# Altium schematic sheet robotShield.SchDoc: RobotShield Atmega328p
size 431 x 279 mm; Author: Mahdi Nikkhah; Engineer: Mahdi Nikkhah; SheetNumber: 1; SheetTotal: 1
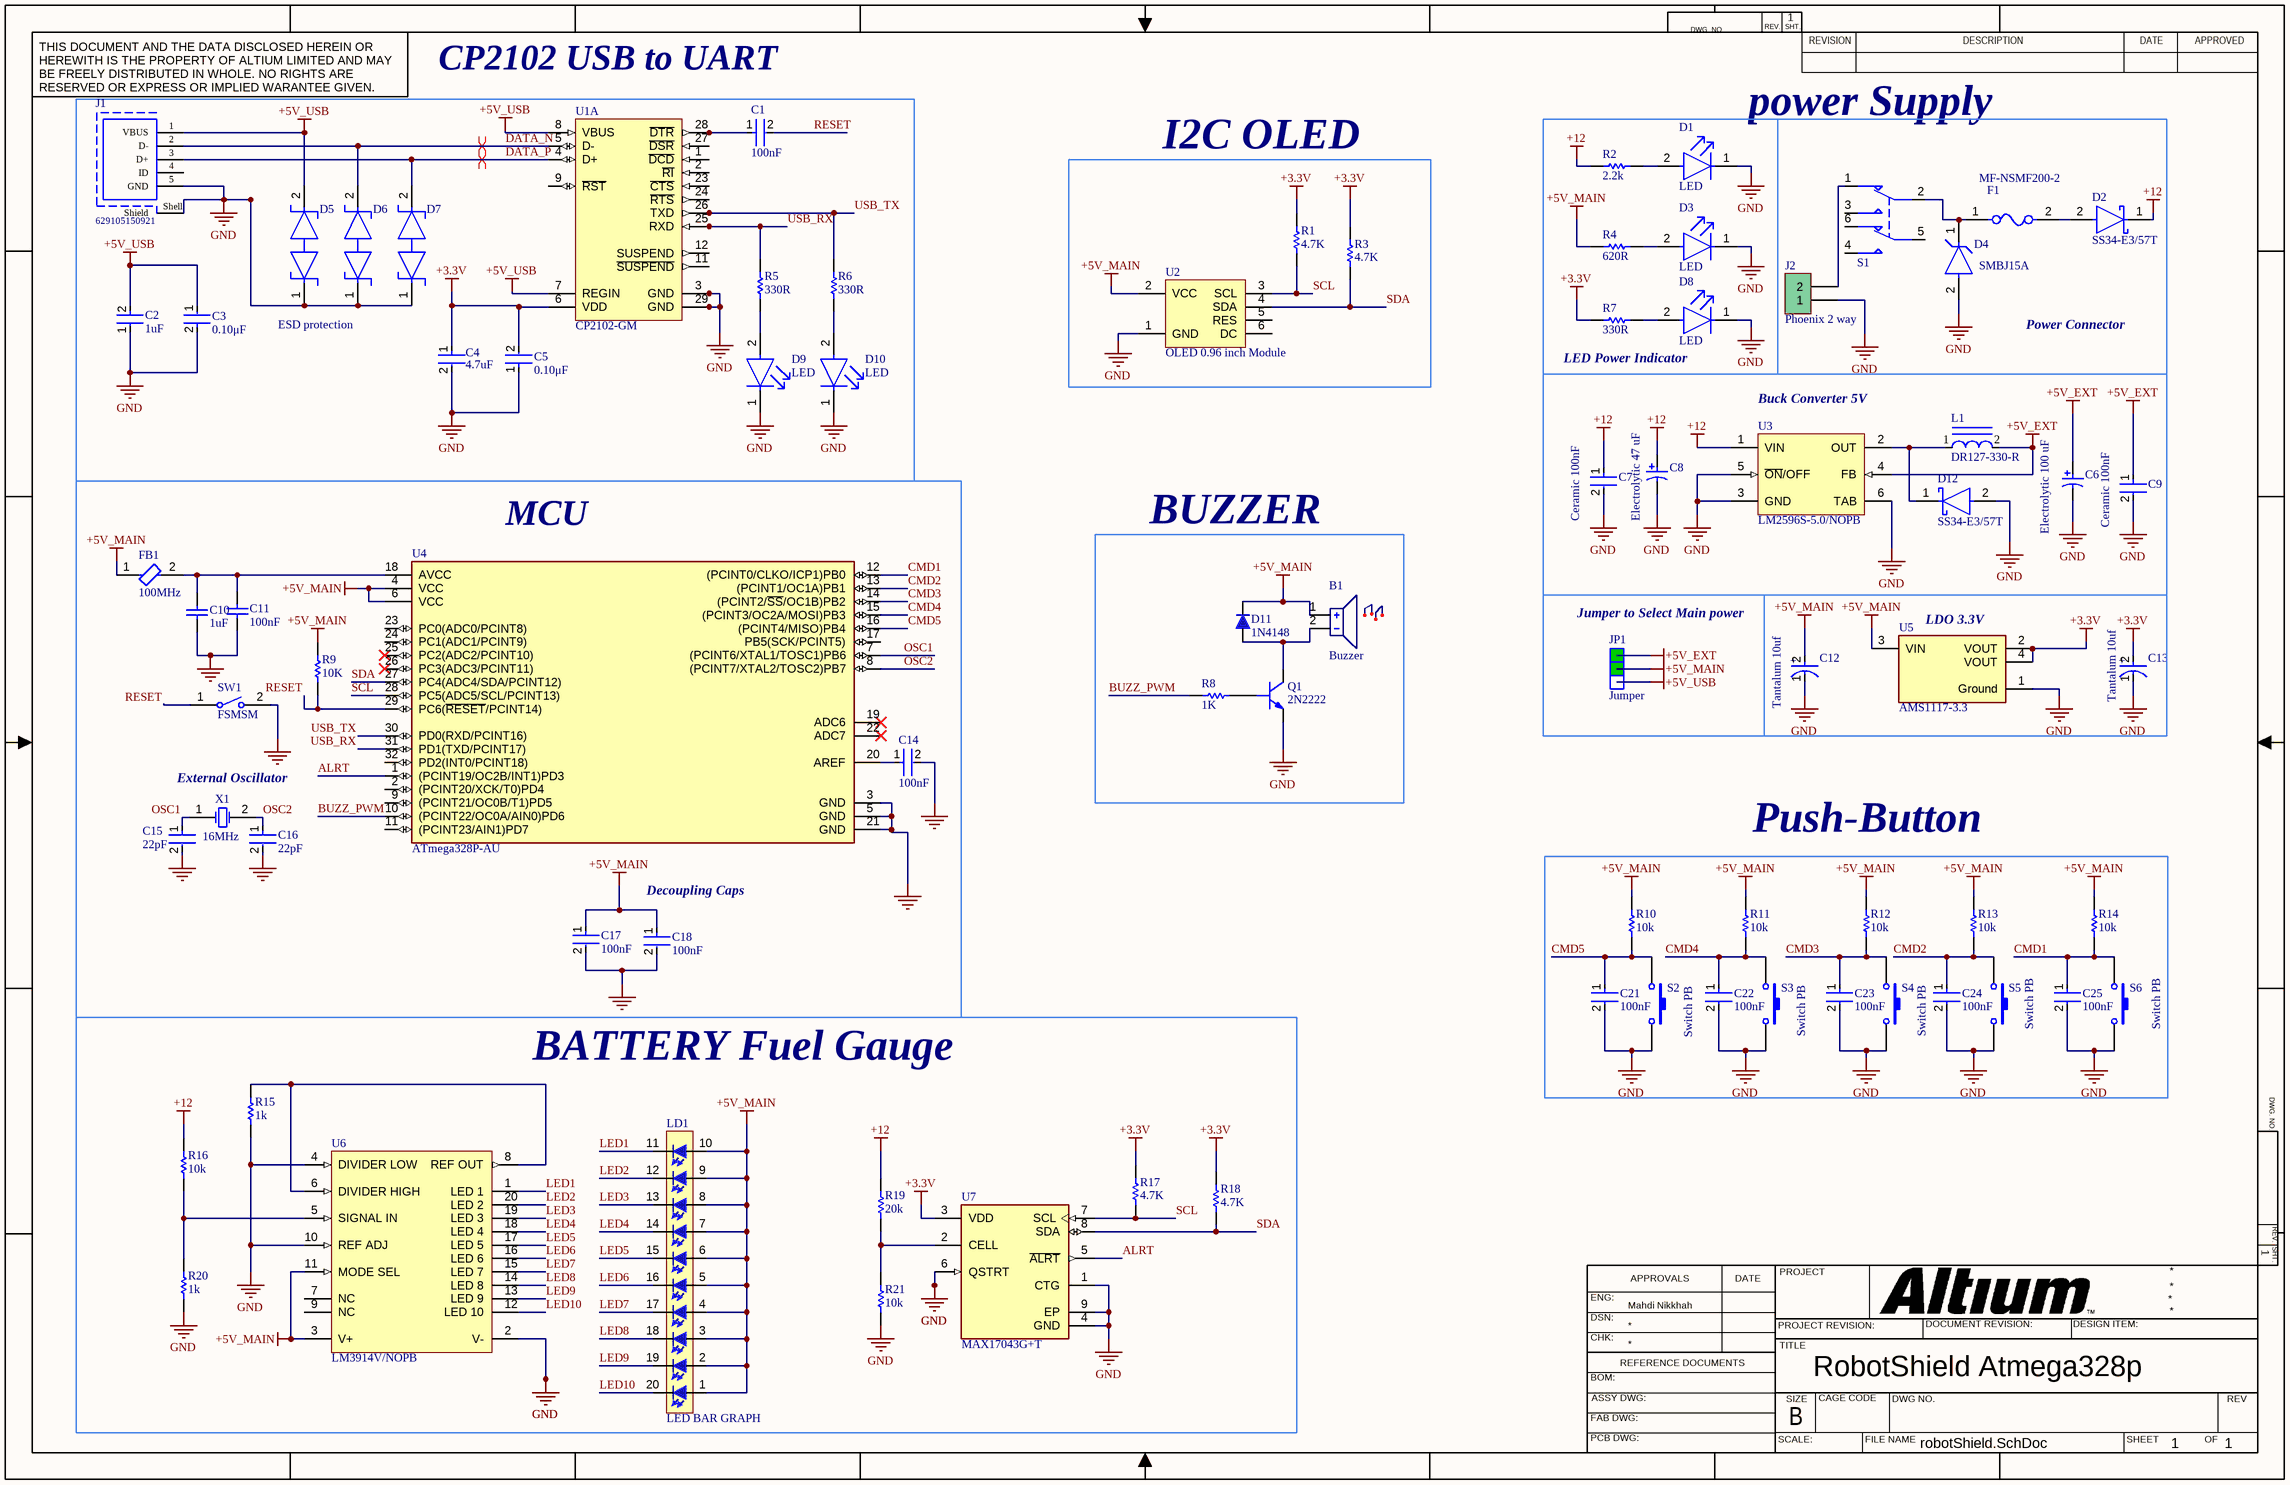
[diagram p0: robotShield.SchDoc]

## Parts
B1  Buzzer  [Buzzer 3M]
C1  100nF  [FP-GRM21B-0_15-MFG]
C2  value 1uF  [FP-GRM15-0_1-MFG]  (hidden comment: GRM155R61A105KE15D)
C3  value 0.10μF  [FP-GRM15-MFG]  (hidden comment: GRM155R71C104KA88D)
C4  Capacitance: 4.7uF  [FP-C1005-050-0_15-MFG]  (hidden comment: C1005X5R1A475K050BC)
C5  value 0.10μF  [FP-GRM15-MFG]  (hidden comment: GRM155R71C104KA88D)
C6  Electrolytic 100 uF  [PNSC-EEEFK1C101P_L]
C7  Ceramic 100nF  [FP-1206-L_3_2_0_2-W_1_6_0-MFG]
C8  Electrolytic 47 uF  [PNSC-FT-V-53x53-2_V]
C9  Ceramic 100nF  [FP-1206-L_3_2_0_2-W_1_6_0-MFG]
C10  1uF  [CAPC3216X95X55NL15T25]
C11  100nF  [CAPC3216X95X55NL15T25]
C12  Tantalum 10uf  [FP-TAJA-MFG]
C13  Tantalum 10uf  [FP-TAJA-MFG]
C14  100nF  [FP-GRM21B-0_15-MFG]
C15  22pF  [FP-C1206C-EB-MFG]
C16  22pF  [FP-C1206C-EB-MFG]
C17  100nF  [FP-GRM21B-0_15-MFG]
C18  100nF  [FP-GRM21B-0_15-MFG]
C21  100nF  [FP-GRM21B-0_15-MFG]
C22  100nF  [FP-GRM21B-0_15-MFG]
C23  100nF  [FP-GRM21B-0_15-MFG]
C24  100nF  [FP-GRM21B-0_15-MFG]
C25  100nF  [FP-GRM21B-0_15-MFG]
D1  LED  [FP-HSMG-C150-MFG]
D2  SS34-E3/57T  [FP-95402-MFG]
D3  LED  [FP-HSMG-C150-MFG]
D4  SMBJ15A  [FP-SMBJ-MFG]
D5  TPD1E10B06DPYR  [FP-DPY0002A-MFG]  (value not drawn)
D6  TPD1E10B06DPYR  [FP-DPY0002A-MFG]  (value not drawn)
D7  TPD1E10B06DPYR  [FP-DPY0002A-MFG]  (value not drawn)
D8  LED  [FP-HSMG-C150-MFG]
D9  LED  [FP-HSMG-C150-MFG]
D10  LED  [FP-HSMG-C150-MFG]
D11  1N4148  [SOD-123]
D12  SS34-E3/57T  [FP-95402-MFG]
F1  MF-NSMF200-2  [FP-MF-NSMF200-2-MFG]
FB1  100MHz  [FP-BLM21-0_2-t0_85-e0_5-IPC_A]
J1  629105150921  [629105150921]
J2  Phoenix 2 way  [Phoenix 2 way 5.08mm V]
JP1  Jumper  [jumper selector]
L1  DR127-330-R  [FP-DR127-MFG]
LD1  LED BAR GRAPH  [LED BAR GRAPH W]
Q1  2N2222  [SOT-23]
R1  4.7K  [RESC2013X60X35ML10T20]
R2  2.2k  [RESC2013X60X35ML10T20]
R3  4.7K  [RESC2013X60X35ML10T20]
R4  620R  [RESC2013X60X35ML10T20]
R5  330R  [RESC2013X60X35ML10T20]
R6  330R  [RESC2013X60X35ML10T20]
R7  330R  [RESC2013X60X35ML10T20]
R8  1K  [RESC2013X60X35ML10T20]
R9  10K  [RESC3116X65X40ML10T20]
R10  10k  [RESC2013X60X35ML10T20]
R11  10k  [RESC2013X60X35ML10T20]
R12  10k  [RESC2013X60X35ML10T20]
R13  10k  [RESC2013X60X35ML10T20]
R14  10k  [RESC2013X60X35ML10T20]
R15  1k  [RESC2013X60X35ML10T20]
R16  10k  [RESC2013X60X35ML10T20]
R17  4.7K  [RESC2013X60X35ML10T20]
R18  4.7K  [RESC2013X60X35ML10T20]
R19  20k  [RESC2013X60X35ML10T20]
R20  1k  [RESC2013X60X35ML10T20]
R21  10k  [RESC2013X60X35ML10T20]
S1  Double Switch  [Switch - DPDT]  (value not drawn)
S2  Switch PB  [SW-PB]
S3  Switch PB  [SW-PB]
S4  Switch PB  [SW-PB]
S5  Switch PB  [SW-PB]
S6  Switch PB  [SW-PB]
SW1  FSMSM  [TECO-FSMSM-2_V]
U1  CP2102-GM  [SLAB-QFN-28-3125x3125TP_N]  (part A of 2)
U2  OLED 0.96 inch Module  [OLED 0.96 inch Module]
U3  LM2596S-5.0/NOPB  [KTT0005B_M]
U4  ATmega328P-AU  [FP-32A-MFG]
U5  AMS1117-3.3  [FP-AMS1117-IPC_C]
U6  LM3914V/NOPB  [FN0020A_L]
U7  MAX17043G+T  [FP-T823-1-MFG]
X1  16MHz  [FOX-FOXSDLF160-20_V]

## Blocks framed on the sheet
ESD protection: C1-C5 D5-D7 D9 D10 J1 R5 R6 U1
I2C OLED: R1 R3 U2
power Supply: D1 D3 D8 R2 R4 R7
Power Connector: D2 D4 F1 J2 S1
MCU: C10 C11 C14-C18 FB1 R9 SW1 U4 X1
BUZZER: B1 D11 Q1 R8
Jumper to Select Main power: JP1
LDO 3.3V: C12 C13 U5
Push-Button: C21-C25 R10-R14 S2-S6
BATTERY Fuel Gauge: LD1 R15-R21 U6 U7

## Nets
+3.3V: C4.1 C5.2 C13.2(A) R1.2 R3.2 R7.1 R17.2 R18.2 U1.6(VDD) U5.2(VOUT) U5.4(VOUT) U7.3(VDD)
+5V_EXT: C6.1 C9.1 JP1.1 L1.2 U3.4(FB)
+5V_MAIN: B1.1 C12.2(A) C17.1 C18.1 D11.2(K) FB1.1 JP1.2 LD1.1(A) LD1.2(A) LD1.3(A) LD1.4(A) LD1.5(A) LD1.6(A) LD1.7(A) LD1.8(A) LD1.9(A) LD1.10(A) R4.1 R9.1 R10.2 R11.2 R12.2 R13.2 R14.2 U2.2(VCC) U4.4(VCC) U4.6(VCC) U5.3(VIN) U6.3(V+) U6.11(MODE_SEL)
+5V_USB: C2.2 C3.1 D5.2 J1.1(VBUS) JP1.3 U1.7(REGIN) U1.8(VBUS)
+12: C7.1 C8.1 D2.1(C) R2.1 R16.2 R19.2 U3.1(VIN)
GND: C2.1 C3.2 C4.2 C5.1 C6.2 C7.2 C8.2 C9.2 C10.1 C11.1 C12.1(C) C13.1(C) C14.2 C15.2 C16.2 C17.2 C18.2 C21.2 C22.2 C23.2 C24.2 C25.2 D1.1(C) D3.1(C) D4.2(A) D5.1 D6.1 D7.1 D8.1(C) D9.1(C) D10.1(C) D12.2(A) J1.5(GND) J1.Shell(Shield) J2.1 Q1.2(EMITTER) R15.2 R20.1 R21.1 S2.2 S3.2 S4.2 S5.2 S6.2 SW1.2 U1.3(GND) U1.29(GND) U2.1(GND) U3.3(GND) U3.5(~{ON}/OFF) U3.6(TAB) U4.3(GND) U4.5(GND) U4.21(GND) U5.1(Ground) U6.2(V-) U6.4(DIVIDER_LOW) U6.10(REF_ADJ) U7.1(CTG) U7.4(GND) U7.6(QSTRT) U7.9(EP)
ALRT: U4.1((PCINT19/OC2B/INT1)PD3) U7.5(~{ALRT})
BUZZ_PWM: R8.2 U4.10((PCINT22/OC0A/AIN0)PD6)
CMD1: C25.1 R14.1 S6.1 U4.12((PCINT0/CLKO/ICP1)PB0)
CMD2: C24.1 R13.1 S5.1 U4.13((PCINT1/OC1A)PB1)
CMD3: C23.1 R12.1 S4.1 U4.14((PCINT2/~{SS}/OC1B)PB2)
CMD4: C22.1 R11.1 S3.1 U4.15((PCINT3/OC2A/MOSI)PB3)
CMD5: C21.1 R10.1 S2.1 U4.16((PCINT4/MISO)PB4)
DATA_N: D6.2 J1.2(D-) U1.5(D-)
DATA_P: D7.2 J1.3(D+) U1.4(D+)
LED1: LD1.11(K) U6.1(LED_1)
LED2: LD1.12(K) U6.20(LED_2)
LED3: LD1.13(K) U6.19(LED_3)
LED4: LD1.14(K) U6.18(LED_4)
LED5: LD1.15(K) U6.17(LED_5)
LED6: LD1.16(K) U6.16(LED_6)
LED7: LD1.17(K) U6.15(LED_7)
LED8: LD1.18(K) U6.14(LED_8)
LED9: LD1.19(K) U6.13(LED_9)
LED10: LD1.20(K) U6.12(LED_10)
OSC1: C15.1 U4.7((PCINT6/XTAL1/TOSC1)PB6) X1.1(X1)
OSC2: C16.1 U4.8((PCINT7/XTAL2/TOSC2)PB7) X1.2(X2)
RESET: C1.2 R9.2 SW1.1 U4.29(PC6(~{RESET}/PCINT14))
SCL: R1.1 R17.1 U2.3(SCL) U4.28(PC5(ADC5/SCL/PCINT13)) U7.7(SCL)
SDA: R3.1 R18.1 U2.4(SDA) U4.27(PC4(ADC4/SDA/PCINT12)) U7.8(SDA)
USB_RX: R5.2 U1.25(RXD) U4.31(PD1(TXD/PCINT17))
USB_TX: R6.2 U1.26(TXD) U4.30(PD0(RXD/PCINT16))
NetB1_2: B1.2 D11.1(A) Q1.3(COLLECTOR)
NetC1_1: C1.1 U1.28(~{DTR})
NetC10_2: C10.2 C11.2 FB1.2 U4.18(AVCC)
NetC14_1: C14.1 U4.20(AREF)
NetD1_2: D1.2(A) R2.2
NetD2_2: D2.2(A) F1.2
NetD3_2: D3.2(A) R4.2
NetD4_1: D4.1(C) F1.1 S1.2
NetD8_2: D8.2(A) R7.2
NetD9_2: D9.2(A) R5.1
NetD10_2: D10.2(A) R6.1
NetD12_1: D12.1(C) L1.1 U3.2(OUT)
NetJ2_2: J2.2 S1.1
NetQ1_1: Q1.1(BASE) R8.1
NetR15_1: R15.1 U6.6(DIVIDER_HIGH) U6.8(REF_OUT)
NetR16_1: R16.1 R20.2 U6.5(SIGNAL_IN)
NetR19_1: R19.1 R21.2 U7.2(CELL)

Not connected (* = marked no-connect by the designer): J1 4(ID); S1 3 4 5 6; U1 1(~{DCD}) 2(~{RI}) 9(~{RST}) 11(~{SUSPEND}) 12(SUSPEND) 23(~{CTS}) 24(~{RTS}) 27(~{DSR}); U2 5(RES) 6(DC); U4 2((PCINT20/XCK/T0)PD4) 9((PCINT21/OC0B/T1)PD5) 11((PCINT23/AIN1)PD7) 17(PB5(SCK/PCINT5)) 19(ADC6)* 22(ADC7)* 23(PC0(ADC0/PCINT8)) 24(PC1(ADC1/PCINT9)) 25(PC2(ADC2/PCINT10))* 26(PC3(ADC3/PCINT11))* 32(PD2(INT0/PCINT18)); U6 7(NC) 9(NC)

## Layout directives
differential pair: DATA_N, DATA_P

## Notes on the sheet
- CP2102 USB to UART
- LED Power Indicator
- (near U3) Buck Converter 5V
- External Oscillator
- Decoupling Caps
- DWG. NO.
- REV.
- SHT.
- THIS DOCUMENT AND THE DATA DISCLOSED HEREIN OR HEREWITH IS THE PROPERTY OF ALTIUM LIMITED AND MAY BE FREELY DISTRIBUTED IN WHOLE. NO RIGHTS ARE RESERVED OR EXPRESS OR IMPLIED WARANTEE GIVEN.
- REVISION
- DESCRIPTION
- DATE
- APPROVED
- ENG:
- APPROVALS
- PROJECT
- DSN:
- CHK:
- REFERENCE DOCUMENTS
- PROJECT REVISION:
- TITLE
- DOCUMENT REVISION:
- DESIGN ITEM:
- BOM:
- FAB DWG:
- PCB DWG:
- ASSY DWG:
- SCALE:
- SIZE
- B
- CAGE CODE
- FILE NAME
- DWG NO.
- SHEET
- OF
- REV
- (in symbol CMP-1661-00004-2) +

## Library data of the parts
B1 = Buzzer New
C1 C14 C17 C18 C21-C25 = CMP-2007-03385-2: Chip Multilayer Ceramic Capacitors for General Purpose, 0805, 22uF, X5R, 15%, 20%, 6.3V; Material: Ceramic; Max Operating Temperature: 85°C; Voltage: 6.3V; Min Operating Temperature: -55°C; Case/Package: 0805; Thickness: 0.053inch; Dielectric: X5R; Packaging: Tape and Reel; Depth: 1.25mm; Termination: SMD/SMT; Voltage Rating (DC): 6.3V; Radiation Hardening: No; Tolerance: 20%; Mount: Surface Mount; Lead Free: Lead Free; Package Quantity: 1; REACH SVHC: No SVHC; Voltage Rating: 6.3V; Capacitance: 22uF; Length: 2mm; Case Code (Imperial): 0805; Case Code (Metric): 2012; Width: 0.049inch; Height: 1.25mm
C2 = CMP-2008-04556-2: CAP CER 1UF 10V X5R 0402; Manufacturer: Murata; Material: Ceramic; Tolerance: 10%; Temperature Coefficient: 15%; Octopart: https://octopart.com/grm155r61a105ke15d-murata-197442; Manufacturer Part Number: GRM155R61A105KE15D; Lead Free: Yes; ComponentLink2Description: Datasheet; Temperature: -55°C to +85°C; Temperature Range High: +85°C; Height: 0.55mm; Capacitance: 1uF; Ipc Land Pattern Name: CAPC10050X50; ComponentLink2URL: https://search.murata.co.jp/Ceramy/image/img/A01X/G101/ENG/GRM155R61A105KE15-01A.pdf; Temperature Range Low: -55°C; Device Class L2: Capacitors; Voltage Rating: 10V; RoHS: TRUE; Device Class L1: Passive Components; Device Class L3: Ceramic Capacitors; Temperature Characteristic: X5R; Mouser Description: 0402 1 uF 10 V ±10% Tolerance X5R Surface Mount Multilayer Ceramic Capacitor; Automotive: No; Package: GRM15-0.1; Digikey Description: CAP CER 1UF 10V X5R 0402; Category: Cap
C3 C5 = CMP-2100-03641-2: CAP CER 0.1UF 16V X7R 0402; Manufacturer: Murata; Standoff Height: 0mm; Tolerance: 10%; Voltage Rating: 16Vdc; Material: Ceramic; RoHS: TRUE; Manufacturer Part Number: GRM155R71C104KA88D; Temperature Characteristic: X7R; Octopart: https://octopart.com/grm155r71c104ka88d-murata-196880; Digikey Description: CAP CER 0.1UF 16V X7R 0402; Device Class L3: Ceramic Capacitors; Height: 0.55mm; ComponentLink2Description: Datasheet; Temperature Range Low: -55°C; Ipc Land Pattern Name: CAPC10050X219; ComponentLink2URL: https://search.murata.co.jp/Ceramy/image/img/A01X/G101/ENG/GRM155R71H471KA01-01A.pdf; Device Class L1: Passive Components; Lead Free: yes; Category: Cap; Package: GRM15; Temperature: -55°C to +125°C; Device Class L2: Capacitors; Capacitance: 0.10μF; Temperature Range High: +125°C; Mouser Description: 0402 0.1 uF 16V ±10 % Tolerance X7R SMT Multilayer Ceramic Capacitor
C4 = CMP-2000-05997-2: CAP CER 4.7UF 10V X5R 0402; Dielectric Material: Ceramic; Tolerance: 10%; Series: C; Package Quantity: 10000; Max Operating Temperature: 85°C; Case Code (Imperial): 0402; Lead Free: Lead Free; Voltage Rating (DC): 10V; Packaging: Cut Tape; Voltage Rating: 10V; Min Operating Temperature: -55°C; Dielectric: X5R; Thickness: 0.022inch; Width: 0.02inch; Case/Package: 0402; Case Code (Metric): 1005; Length: 0.039inch; RoHS Compliant: Yes; REACH SVHC: No SVHC; Mount: Surface Mount
C6 = CMP-2000-06203-1: Aluminum Electrolytic Capacitor, 100 uF, 20%, 16 V, -55 to 105 degC, 2-Pin SMD, RoHS, Tape and Reel; Manufacturer: Panasonic; Lifetime@Temperature: 2000Hrs@105°C; Impedance: 0.36O; Ripple Current: 240mA; Rated Voltage: 16V; Type: Can; Capacitance: 100µF; Datasheet URL: http://datasheet.octopart.com/EEEFK1C101P-Panasonic-datasheet-13266987.pdf; Package Description: 2-Pin Surface Mount Device, Body 6.6 x 6.6 mm; Manufacturer URL: http://www.panasonic.com/; Case Size/Dimension: Ø6.3x5.8mm; Series: FK; Datasheet Version: 11/2012; Mounting Technology: SurfaceMount; Package Reference: EEEFK1C101P; Operating Temp-Max: 105°C; Operating Temp Range: -55to+105°C
C7 C9 = CMP-2000-05018-2: General Purpose Ceramic Capacitor, 1206, 100nF, 10%, X7R, 15%, 50V; Dissipation Factor: 2.5%; Insulation Resistance: 100GR; Dielectric: X7R; Thickness: 0.037inch; Case Code (Imperial): 1206; Case Code (Metric): 3216; Dielectric Material: Ceramic; Width: 1.6mm; Voltage Rating (DC): 50V; Termination: SMD/SMT; Tolerance: 10%; REACH SVHC: No SVHC; Height: 0.94mm; Length: 3.2mm; Voltage: 50V; Capacitance: 100nF; Packaging: Tape and Reel; Depth: 1.6mm; Voltage Rating: 50V; Series: -; Contact Plating: Tin; Mount: Surface Mount; Package Quantity: 1; Construction: Flat; Max Operating Temperature: 125°C; Min Operating Temperature: -55°C; Case/Package: 1206; Lead Free: Lead Free; RoHS Compliant: Yes; Number of Pins: 2; Radiation Hardening: No
C8 = CMP-0744-00003-1: Aluminum Electrolytic Capacitor, 47 uF +/- 20%, 25 V, -55 to 105 degC, 2-Pin 5.3 x 5.3 x 6.1 mm SMD, RoHS, Tape and Reel; PartNumber: EEE-FT1E470AR; Manufacturer: Panasonic; Cap.: 47 uF; Ripple Current: 240 mA; Rated Voltage: 25 V; Capacitance Tolerance: +/- 20%; ComponentLink3Description: Package Specification; RoHS: TRUE; PackageReference: FT-V-53x53-2; DatasheetVersion: Mar-14; Temp. Range: -55 to 105 degC; ComponentLink2URL: http://industrial.panasonic.com/www-data/pdf/ABA0000/ABA0000CE135.pdf; PackageDescription: 2-Pin SMD, Body 5.3 x 5.3 mm, Height 6.1 mm; ComponentLink3URL: http://industrial.panasonic.com/www-data/pdf/ABA0000/ABA0000PE248.pdf; Mounting Technology: Surface Mount; ComponentLink2Description: Datasheet; ComponentLink1URL: http://www.panasonic.com/industrial/electronic-components/; PackageVersion: Feb-14; Packing: Tape and Reel; ComponentLink1Description: Manufacturer URL
C10 C11 = CMP-1662-00007-4: Chip Capacitor, 0.1 uF, +/- 10%, 50 V, -55 to 125 degC, 1206 (3216 Metric), RoHS, Tape and Reel; Manufacturer: Murata; Voltage Rating: 50 V; Lead Pitch: 4 mm; PackageDescription: 2-Pin Surface Mount Device, Body 3.2 x 1.6 mm; DatasheetVersion: 03/2016; Min Operating Temperature: -55 degC; Package Quantity: 4000; RoHSCompliant: true; Max Operating Temperature: 125 degC; Height: 0.85 mm; Pins: 2; Length: 3.2 mm; PackageReference: 1206 (3216 Metric); Mounting Technology: Surface Mount; ComponentLink1Description: Manufacturer URL; ComponentLink2Description: Datasheet; ComponentLink1URL: http://www.murata.com/; Mount: Surface Mount; REACH SVHC: No SVHC; Packaging: Tape and Reel; ComponentLink2URL: http://search.murata.co.jp/Ceramy/image/img/A01X/G101/ENG/GRM319R71H104KA01-01.pdf
C12 C13 = CMP-1661-00004-2: 10uF 16V  ±10% 3Ω 1206  SMD Tantalum Capacitor; ESR (Equivalent Series Resistance): 3R; Leakage Current: 1.6uA; Dissipation Factor: 8%; Polarity: Polar; Length: 3.2mm; Features: General Purpose; Voltage Rating: 16V; Voltage: 16V; Mount: Surface Mount; Case/Package: 1206; Number of Pins: 2; Case Code (Metric): 3216; Radiation Hardening: No; Min Operating Temperature: -55°C; Case Code (Imperial): 1206; Height - Seated (Max): 0.071inch; Lead Free: Lead Free; Termination: SMD/SMT; Dielectric Material: Tantalum; Width: 1.6mm; Tolerance: 10%; Capacitance: 10uF; Lead Pitch: 1.1mm; Max Operating Temperature: 125°C; Voltage Rating (DC): 16V; Packaging: Tape and Reel; Package Quantity: 1; REACH SVHC: No SVHC; Depth: 1.6mm; Height: 1.6mm
C15 C16 = CMP-1037-00989-2: CAP CER 22PF 100V 5% NP0 1206; Manufacturer Part Number: C1206C220J1GACTU; Manufacturer: KEMET; Material: Ceramic; Automotive Grade: Grade 0; Tolerance: 0.05; Temperature Characteristic: C0G; Temperature Coefficient: 15%; Capacitance: 22 pF; Value: 22 pF; Mouser Description: 1206 22pF Ceramic Multilayer Capacitor; 100VDC; 125degC; C0G Dielec; +/-5% SMD; ComponentLink2Description: Datasheet; Digikey Description: CAP CER 22PF 100V 5% NP0 1206; Automotive: Yes; Temperature: -55°C to +150°C; Lead Free: Yes; Height: 0.88mm; Device Class L3: Ceramic Capacitors; Ipc Land Pattern Name: CAPC320160X78; ComponentLink2URL: https://content.kemet.com/datasheets/KEM_C1007_X8R_ULTRA_150C_SMD.pdf; Temperature Range High: +150°C; Device Class L1: Passive Components; Temperature Range Low: -55°C; Voltage Rating: 100 V; Category: Cap; Device Class L2: Capacitors; Octopart: https://octopart.com/c1206c220j1gactu-kemet-9145181; RoHS: TRUE; Package: C1206C-EB
D1 D3 D8-D10 = CMP-2000-05061-2: LED GREEN DIFFUSED 1206 SMD; Manufacturer Part Number: HSMG-C150; Manufacturer: Broadcom; Led Orientation: Top View; Max Junction Temp: +95°C; Peak Emmision Wavelength: 570nm; Viewing Angle: 170°; Wavelength: 572nm; Reverse Voltage: 5V; Luminous Intensity: 15mcd; Forward Voltage: 2.2V; Power Dissipation: 65mW; Forward Current: 20mA; ComponentLink2Description: Datasheet; Lead Free: Yes; Temperature Range Low: -40°C; Package: HSMG-C150; Digikey Description: LED GREEN DIFFUSED 1206 SMD; Mouser Description: LED Uni-Color Green 570nm 2-Pin Chip LED T/R; Temperature Range High: +85°C; Device Class L1: Optoelectronics; Colour: Green; Category: Diode; Device Class L3: unset; RoHS: TRUE; Height: 1.2mm; ComponentLink2URL: https://docs.broadcom.com/docs/AV02-0551EN; Device Class L2: LEDs; Automotive: No; Ipc Land Pattern Name: DIOCP320160X55; Octopart: https://octopart.com/hsmg-c150-broadcom-71131304; Temperature: -40°C to +85°C
D2 D12 = CMP-02539-000012-1: DIODE SCHOTTKY 40V 3A DO214AB; Manufacturer: Vishay; Max Junction Temp: +150°C; Peak Reverse Current: 0.5mA; Max Surge Forward Current: 100A; Standoff Height: 0mm; ComponentLink2Description: Datasheet; Device Class L3: Schottky Diodes; Height: 2.62mm; Max Repetitive Reverse Voltage: 40V; Lead Free: Yes; Package: 95402; Temperature Range High: +150°C; ComponentLink2URL: http://www.vishay.com/docs/88751/ss32.pdf; Temperature: -55°C to +150°C; Footprint Url: http://www.vishay.com/docs/95402/smc.pdf; Automotive: No; Forward Current: 3A; Category: Diode; Manufacturer Part Number: SS34-E3/57T; RoHS: TRUE; Device Class L2: Diodes; Mouser Description: Schottky Diodes & Rectifiers 3.0 Amp 40 Volt; Octopart: https://octopart.com/ss34-e3%2F57t-vishay-39552907; Temperature Range Low: -55°C; Device Class L1: Discrete Semiconductors; Digikey Description: DIODE SCHOTTKY 40V 3A DO214AB
D4 = CMP-07401-000033-1: TVS DIODE 15VWM 24.4VC SMB; Max Breakdown Voltage: 19.2V; Reverse Standoff Voltage: 15V; Number of Elements: 1; Diode Type: ZENER; Max Reverse Leakage Current: 5uA; Operating Supply Voltage: 3.5V; Element Configuration: Single; Reverse Breakdown Voltage: 16.7V; Peak Pulse Power: 600W; Peak Pulse Current: 24A; Polarity: Unidirectional; Clamping Voltage: 24.4V; ESD Protection: Yes; Test Current: 1mA; Power Line Protection: No; Max Surge Current: 100A; Min Operating Temperature: -55°C; Number of Pins: 2; Case/Package: DO-214AA; Number of Channels: 1; Series: SMBJ; Height: 2.42mm; Resistor Type: Zener; Max Power Dissipation: 600W; REACH SVHC: No SVHC; Package Quantity: 1; Breakdown Voltage: 19.2V; Radiation Hardening: No; Direction: Unidirectional; Number of Unidirectional Channels: 1; Termination: SMD/SMT; Length: 4.57mm; Width: 3.94mm; Packaging: Tape and Reel; Leakage Current: 5uA; RoHS Compliant: Yes; Mount: Surface Mount; Min Breakdown Voltage: 16.7V; Max Operating Temperature: 150°C
D5-D7 = CMP-0326-00004-4: TVS DIODE 5.5V 14V 2X1SON; Leakage Current: 100nA; Min Breakdown Voltage: 6V; Number of Channels: 1; ESD Protection: Yes; Power Line Protection: No; Test Current: 1mA; Interface: GPIO; Element Configuration: Single; Peak Pulse Current: 5A; Direction: Bidirectional; Peak Pulse Power: 90W; Capacitance: 12pF; Composition: Zener; Packaging: Tape and Reel; Number of Pins: 2; Breakdown Voltage: 6V; Radiation Hardening: No; Min Operating Temperature: -40°C; Contact Plating: Gold; Lead Free: Lead Free; Height: 0.35mm; REACH SVHC: No SVHC; Case/Package: 0402; Max Operating Temperature: 125°C; Width: 0.7mm; Clamping Voltage: 14V; Package Quantity: 1; Max Reverse Leakage Current: 100nA; Working Voltage: 5.5V; Length: 1.1mm; Number of Bidirectional Channels: 1; Reverse Standoff Voltage: 5.5V
F1 = CMP-07400-000004-1: PTC RESET FUSE 12V 2A 1206; Manufacturer: Bourns Inc.; Trip Time: 1s; Automotive Grade: Grade 3; Value: 85mΩ; Trip Current: 4A; Voltage Rating: 6V; Current Rating: 100A; RoHS: TRUE; Device Class L1: Circuit Protection; Manufacturer Part Number: MF-NSMF200-2; Height: 1.6mm; Device Class L3: unset; Ambient Temperature Range Low: -40°C; ComponentLink2URL: https://bourns.com/docs/product-datasheets/mfnsmf.pdf?sfvrsn=39c76af6_14; Lead Free: Yes; Temperature Range High: +85°C; Temperature Range Low: -40°C; Octopart: https://octopart.com/mf-nsmf200-2-bourns-90790; Ipc Land Pattern Name: CAPC325160X115; Device Class L2: PTC Resettable Fuses; ComponentLink2Description: Datasheet; Package: MF-NSMF200-2; Mouser Description: Resettable Fuses - PPTC 2V 6V 0.02ohm (R); Ambient Temperature Range High: +85°C; Hold Current: 2A; Digikey Description: PTC RESET FUSE 6V 2A 1206; Category: Fuse; Temperature: -40°C to +85°C; Automotive: Yes; Resistance: 85mΩ
FB1 = CMP-0686-00716-3: FERRITE BEAD 120 OHM 0805 1LN; Number of Lines: 1; DC Resistance-Max: 100mR; Material: Steel; Max DC Current: 200mA; Shielding: Unshielded; Impedance: 120R; Current Rating: 800mA; Max Current Rating: 1A; Resistance: 150mR; Tolerance: 25%; Width: 1.25mm; Number of Circuits: 1; Military Standard: Not; Height: 0.85mm; Test Frequency: 100MHz; Series: BLM21A; Min Operating Temperature: -55°C; DC Resistance (DCR): 100mR; Termination: SMD/SMT; Core Material: Ferrite; REACH SVHC: No SVHC; Radiation Hardening: No; Max Operating Temperature: 125°C; Number of Pins: 2; Case/Package: 0805; Case Code (Imperial): 0805; Frequency: 100MHz; Depth: 1.25mm; Length: 2mm; DC Current: 200mA; Lead Free: Lead Free; Case Code (Metric): 2012; Package Quantity: 1; Packaging: Tape and Reel
J1 = 629105150921: Micro USB 2.0 Type AB Receptacle WR-COM, Horizontal, SMT; Rated Current: 1.8 A; Contact Resistance: 30 mOhm; Working Voltage: 30 VAC; ComponentLink1Description: Manufacturer; ComponentLink1URL: http://www.we-online.de; ComponentLink2Description: Datasheet; ComponentLink2URL: https://katalog.we-online.de/em/datasheet/629105150921.pdf; Part Number: 629105150921; Published Date: September 2018; Publisher: Wurth Elektronik; Orientation: Horizontal; Connector Type: Micro USB 2.0 Type AB; Operating Temperature: -40 to 85 degC; Mounting Technology: SMT; Gender: Receptacle; Packaging: Tape and Reel
JP1 = Jumper Selector
L1 = CMP-00112-51190308-2: DR127-330-R Inductor Power Shielded Drum Core 33uH 20% 100KHz Ferrite 3.23A 60mOhm DCR T/R; Series Resistance: 60mΩ; Saturation Current: 6.22A; Inductance: 33µH; Min Operating Temperature: -40°C; REACH SVHC: No SVHC; Self Resonant Frequency: 100kHz; Tolerance: 20%; Packaging: Cut Tape; Width: 12.4968mm; Termination: SMD/SMT; Lead Free: Lead Free; Test Frequency: 100kHz; Shielding: Shielded; Case/Package: Nonstandard; RoHS: Compliant; Max Operating Temperature: 125°C; RMS Current (Irms): 3.23A; Height - Seated (Max): 8.001mm; Number of Pins: 2; Radiation Hardening: No; Resistance: 60mΩ; Composition: Wirewound; Weight: 5.896701g; Mount: Surface Mount; Max DC Current: 6.22A; Height: 8mm; Depth: 12.5mm; Core Material: Ferrite; Military Standard: Not; DC Resistance (DCR): 60mΩ; Inductance Tolerance: 20%; NexarPartId: 51190308; Length: 12.5mm; Schedule B: 8504500000, 8504500000; Current Rating: 3.23A
R1-R8 R10-R21 = CMP-2100-03671-1: Chip Resistor, 1 KOhm, +/- 1%, 125 mW, -55 to 155 degC, 0805 (2012 Metric), RoHS, Tape and Reel; Manufacturer: Yageo; Temperature Coefficient: 100ppm/degreesC; Voltage Rating (DC): 150V; Max Power Dissipation: 125mW; Resistance: 1KOhm; Number of Pins: 2; Number of Terminations: 2; Datasheet URL: http://www.yageo.com/NewPortal/yageodocoutput?fileName=/pdf/R-Chip/PYu-RC_Group_51_RoHS_L_5.pdf; Length: 0.079inch; Package Description: 2-Pin Surface Mounted Device, Body 2 x 1.25 mm; Depth: 1.25mm; Height: 0.024inch; Military Standard: Not; Case/Package: 0805; Package Reference: 0805; RoHSCompliant: true; Lead Free: LeadFree; Packaging: TapeandReel; Package Quantity: 1; Datasheet Version: Rev. 5, 10/2016; Tolerance: 1%; Min Operating Temperature: -55degC; Voltage Rating: 150V; Composition: ThickFilm; Case Code (Imperial): 0805; Power Rating: 125mW; Width: 0.049inch; Case Code (Metric): 2012; Manufacturer URL: http://www.yageo.com/; Max Operating Temperature: 155degC; REACH SVHC: Unknown; Termination: SMD/SMT
R9 = CMP-1014-00623-2: Chip Resistor, 10 KOhm, +/- 1%, 0.25 W, -55 to 155 degC, 1206 (3216 Metric), RoHS, Tape and Reel; Manufacturer: Yageo; Voltage Rating: 200V; Resistance: 10KOhm; Temperature Coefficient: 100ppm/degreesC; Power Rating: 250mW; Packaging: TapeandReel; Termination: SMD/SMT; REACH SVHC: Unknown; Tolerance: 1%; Height: 0.55mm; Composition: ThickFilm; Max Operating Temperature: 155degC; Datasheet Version: Rev. 5, 10/2016; Lead Free: LeadFree; Case Code (Metric): 3216; Depth: 1.6mm; Package Quantity: 5000; RoHSCompliant: true; Military Standard: Not; Case/Package: 1206; Case Code (Imperial): 1206; Min Operating Temperature: -55degC; Datasheet URL: http://www.yageo.com/NewPortal/yageodocoutput?fileName=/pdf/R-Chip/PYu-RC_Group_51_RoHS_L_5.pdf; Length: 3.1mm; Manufacturer URL: http://www.yageo.com/; Package Reference: 1206.0; Width: 1.6mm; Package Description: 2-Pin Surface Mount Device, Body 3.1 x 1.6 mm
S1 = SW_DPDT: DPDT Switch; Company: SJ Libraries; Designer: Eng. Saeid Jorablo; Mounting Technology: Surface Mount\Through-Hole; ComponentLink1Description: Datasheet; Pin Count: 0; Update Date: 6/3/2012; Category: MISC; HelpURL: http://s3.picofile.com/file/7443264187/Coming_Soon_logo.gif
S2-S6 = Switch PB: Push Button Switch
SW1 = CMP-2000-07511-1: FSMSM Push Button Switch, 50 mA, -35 to 85 degC, 2-Pin SMD, RoHS, Bulk; Manufacturer: TE Connectivity; Actuator Length: 1.07mm; Electrical Life: 20000Cycles; Actuator Material: Polyamide; Current Rating: 50mA; Illumination Type: Illuminated; Voltage Rating (DC): 24V; Contact Resistance: 100mOhm; Case\/Package: SMD/SMT; Operating Force: 180gf; Switch Travel: 0.25mm; Max Voltage Rating (DC): 12V; Throw Configuration: SPST; Packaging: LoosePiece; Max Operating Temperature: 85degC; ELV: Compliant; Package Description: 2-Pin Surface Mount Device, Body 6 x 3.5 mm, Pitch 9.19 mm; RoHSCompliant: true; Manufacturer URL: http://www.te.com/; Contact Plating: Silver; Contact Material: Brass; Mounting Technology: SurfaceMount; Contact Current Rating: 50mA; Datasheet Version: Rev. C2, 08/2014; Datasheet URL: http://www.te.com/commerce/DocumentDelivery/DDEController?Action=showdoc&DocId=Customer+Drawing%7F1437566-3%7FC2%7Fpdf%7FEnglish%7FENG_CD_1437566-3_C2_1437566_3_1_c.dwg.pdf%7F1437566-3; Mechanical Life: 20000Cycles; Package Reference: FSMSM; REACH SVHC: Unknown; Orientation: Straight; Min Operating Temperature: -35degC; Lead Free: LeadFree; Termination: GullWing; Package Quantity: 1000; Mount: SurfaceMount
U1 = CMP-0511-00012-1: Single-Chip USB to UART Bridge, 1024 Bytes EEPROM, -40 to 85 degC, 28-pin QFN, Tube; Manufacturer: Silicon Labs; Internal Oscillator: TRUE; Sub-Family: USB Bridges; ComponentLink3Description: Package Specification; PackageDescription: 28-Pin Quad-Flat No-Leads Package, Body 5 x 5 mm, Pitch 0.5 mm; PartNumber: CP2102-GM; EEPROM: 1024 Bytes; Mounting Technology: Surface Mount; ComponentLink2URL: http://www.silabs.com/Support%20Documents/TechnicalDocs/CP2102-9.pdf; DatasheetVersion: Rev. 1.5; ComponentLink1URL: http://www.silabs.com/; ComponentLink2Description: Datasheet; Code_JEDEC: MO-220; PackageReference: QFN-28; Code_IPC: J-STD-020C; ComponentLink3URL: http://www.silabs.com/Support%20Documents/TechnicalDocs/C8051T61x.pdf; ComponentLink1Description: Manufacturer URL
U3 = CMP-0069-00269-3: SIMPLE SWITCHER® Power Converter 150 KHz 3A Step-Down Voltage Regulator, 5-pin TO-263, Pb-Free; Manufacturer: Texas Instruments; PowerWise: N; PackageTopMarking: NSUZXYTTE#*LM2596S*-5.0 P+; ComponentLink1URL: http://www.ti.com/general/docs/lit/getliterature.tsp?genericPartNumber=LM2596&fileType=pdf; PackageDescription: TO-263, Molded, .400 x .390 x .180in, 5 Lead, .067in Pitch, Surface Mount; RoHS: Y; PinCount: 5; Code_JEDEC: MO-169-AB; ComponentLink1Description: Datasheet URL; PackageReference: KTT0005B; CompType: Switcher
U4 = CMP-06276-000013-1: IC MCU 8BIT 32KB FLASH 32TQFP; Manufacturer: Microchip; Nominal Supply Current: 0.04-5.2mA; Number Of Timers/Counters: 3; Number Of Adc Channels: 8; Number Of I2C Channels: 1; Min Supply Voltage: 1.8V; Standoff Height: 0.05mm; Data Bus Width: 8bits; Ram Size: 2KBytes; Max Supply Voltage: 5.5V; Interface: I2C,SPI,UART,USART,2-Wire; Frequency: 20MHz; Number Of Pwm Channels: 6; Memory Size: 32KBytes; Number Of I/Os: 23; Core Architecture: AVR; Temperature: -40°C to +85°C; Number Of Spi Channels: 1; Digikey Description: IC MCU 8BIT 32KB FLASH 32TQFP; Category: IC; RoHS: TRUE; Memory Type: FLASH; Package: 32A; ComponentLink2Description: Datasheet; Number Of Uart Channels: 1; Temperature Range High: +85°C; Octopart: https://octopart.com/atmega328p-au-microchip-77760215; Footprint Url: http://ww1.microchip.com/downloads/en/appnotes/atmel-8826-seeprom-pcb-mounting-guidelines-surface-mount-packages-applicationnote.pdf; Lead Free: Yes; Device Class L1: Integrated Circuits (ICs); Device Class L2: Embedded Processors and Controllers; Ipc Land Pattern Name: QFP80P900X900X120-32; Number Of A/D Converters: 1; Number Of Cores: 1; Automotive: No; Temperature Range Low: -40°C; Mouser Description: ATmega Series 32 KB Flash 2 KB SRAM 20 MHz 8-Bit Microcontroller - TQFP-32; ComponentLink2URL: http://ww1.microchip.com/downloads/en/DeviceDoc/ATmega48A-PA-88A-PA-168A-PA-328-P-DS-DS40002061A.pdf; Height: 1.2mm; Manufacturer Part Number: ATmega328P-AU; Device Class L3: Microcontrollers
U5 = CMP-209535-000001-1: LDO Voltage Regulators 1A, 3.3V; Manufacturer: Advanced Monolithic Systems; Dropout Voltage: 1.1V; Output Type: Fixed; Nominal Supply Current: 5mA; Max Power Dissipation: 1.2W; Max Supply Voltage: 15V; Number Of Outputs: 1; Standoff Height: 0.64mm; Max Junction Temp: +125°C; Height: 1.8mm; Package: AMS1117; Device Class L2: Power Management ICs; ComponentLink2Description: Datasheet; ComponentLink2URL: http://www.advanced-monolithic.com/pdf/ds1117.pdf; Category: IC; RoHS: TRUE; Automotive: No; Device Class L1: Integrated Circuits (ICs); Output Current: 1A; Device Class L3: Voltage Regulators - Linear; Temperature: -40°C to +125°C; Output Voltage: 3.3V; Manufacturer Part Number: AMS1117-3.3; Temperature Range Low: -40°C; Octopart: https://octopart.com/ams1117-3.3-advanced+monolithic+systems-25899300; Lead Free: Yes; Ipc Land Pattern Name: SOT229P700X180-4; Temperature Range High: +125°C
U6 = CMP-0058-00008-4: Dot/Bar Display Driver, 20-pin PLCC, Pb-Free; Manufacturer: Texas Instruments; PowerWise: N; PackageTopMarking: NSUZXYTTE#*LM3914V; CompType: Audio IC; Code_IPC: PLCC-20; Code_JEDEC: MO-047-AA; ComponentLink1URL: http://www.ti.com/general/docs/lit/getliterature.tsp?genericPartNumber=LM3914&fileType=pdf; RoHS: Y; PackageReference: FN0020A; ComponentLink1Description: Datasheet URL; PackageDescription: Plastic Chip Carrier, Sq., .050in Pitch, 20 Lead; PinCount: 20
U7 = CMP-05715-000066-1: IC 2-WIRE FG MODEL GAUGE LO BATT; Manufacturer: Maxim; Max Supply Voltage: 4.5V; Standoff Height: 0mm; Nominal Supply Current: 50uA; Min Supply Voltage: 2.5V; Number Of Cells: 1; Height: 0.8mm; Device Class L3: Battery Management; Package: T823-1; Footprint Url: https://pdfserv.maximintegrated.com/land_patterns/90-0091.PDF; ComponentLink2Description: Datasheet; Lead Free: Yes; RoHS: TRUE; Mouser Description: Battery Management Over Volt Protector Ideal Diode; Digikey Description: IC 2-WIRE FG MODEL GAUGE LO BATT; Device Class L1: Integrated Circuits (ICs); Manufacturer Part Number: MAX17043G+T; Temperature: -20°C to +70°C; Automotive: No; ComponentLink2URL: https://datasheets.maximintegrated.com/en/ds/MAX17043-MAX17044.pdf; Device Class L2: Power Management ICs; Octopart: https://octopart.com/max17043g%2Bt-maxim+integrated-43979038; Category: IC; Temperature Range High: +70°C; Temperature Range Low: -20°C
X1 = CMP-1749-00001-1: Resistance Weld SMD Crystal, 16 MHz, +/- 30 ppm, 20 pF, -20 to 70 degC, 2-Pin SMD, RoHS, Tape and Reel; Output Current: 3 mA; Case\Package: SOT-553-6; Min Supply Voltage (DC): 4 V; Max Supply Voltage: 3.3 V; Min Supply Voltage: 1.4 V; Interface: I2C; Max Supply Voltage (DC): 6 V; ComponentLink2Description: Datasheet; REACH SVHC: No SVHC; ComponentLink1URL: http://www.foxonline.com/; ComponentLink2URL: http://foxonline.com/pdfs/hc49sdlf.pdf; Pins: 6; Packaging: Cut Tape; ComponentLink1Description: Manufacturer URL; Weight: 9.9E-05 oz; Length: 1.6 mm; RoHSCompliant: true; Min Operating Temperature: -55 degC; Radiation Hardening: No; PackageDescription: 2-Pin Surface Mount Device, Body 5 x 11.7 mm, Height 4.5 mm; Package Quantity: 1; Width: 1.2 mm; DatasheetVersion: Mar-15; Max Operating Temperature: 150 degC; Mount: Surface Mount; PackageReference: FOX-FOXSDLF160-20; Height: 0.55 mm